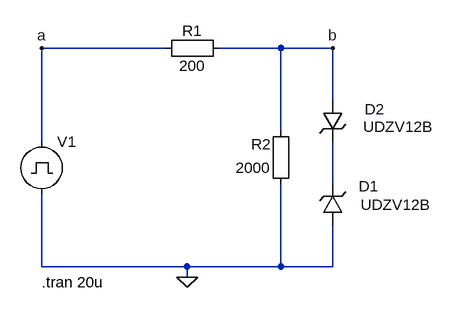
[diagram p0: schematic Z-CL-BIP.asc]
Z-CL-BIP.asc, the LTspice schematic file:
Version 4
SHEET 1 880 680
WIRE 64 -32 -128 -32
WIRE 240 -32 144 -32
WIRE 320 -32 240 -32
WIRE 320 48 320 -32
WIRE 240 96 240 -32
WIRE -128 112 -128 -32
WIRE 320 176 320 112
WIRE -128 304 -128 192
WIRE 96 304 -128 304
WIRE 240 304 240 176
WIRE 240 304 96 304
WIRE 320 304 320 240
WIRE 320 304 240 304
WIRE 96 320 96 304
FLAG -128 -32 a
FLAG 320 -32 b
FLAG 96 320 0
SYMBOL Misc\\EuropeanResistor 160 -48 R90
WINDOW 0 5 56 VBottom 2
WINDOW 3 27 56 VTop 2
SYMATTR InstName R1
SYMATTR Value 200
SYMBOL zener 336 240 R180
WINDOW 0 -55 60 Left 2
WINDOW 3 -135 31 Left 2
SYMATTR InstName D1
SYMATTR Value UDZV12B
SYMATTR Description Diode
SYMATTR Type diode
SYMBOL pulse -128 96 R0
WINDOW 3 24 44 Invisible 2
WINDOW 123 0 0 Left 2
WINDOW 39 0 0 Left 2
SYMATTR Value PULSE(-20V 20V 1u 0.1u 0.1u 2u 5u)
SYMATTR InstName V1
SYMBOL zener 304 48 R0
WINDOW 0 65 14 Left 2
WINDOW 3 63 41 Left 2
SYMATTR InstName D2
SYMATTR Value UDZV12B
SYMATTR Description Diode
SYMATTR Type diode
SYMBOL Misc\\EuropeanResistor 256 192 R180
WINDOW 0 31 76 Left 2
WINDOW 3 31 40 Left 2
SYMATTR InstName R2
SYMATTR Value 2000
TEXT -128 328 Left 2 !.tran 20u

The netlist it stands for:
* Z-CL-BIP.asc
R1 b a 200
D1 0 N001 UDZV12B
V1 a 0 PULSE(-20V 20V 1u 0.1u 0.1u 2u 5u)
D2 b N001 UDZV12B
R2 0 b 2000
.model D D
.lib standard.dio
.tran 20u
.backanno
.end